# EasyEDA Pro project ProPrj_DiscoTech 6 Current_2026-05-06.epro, board Cue
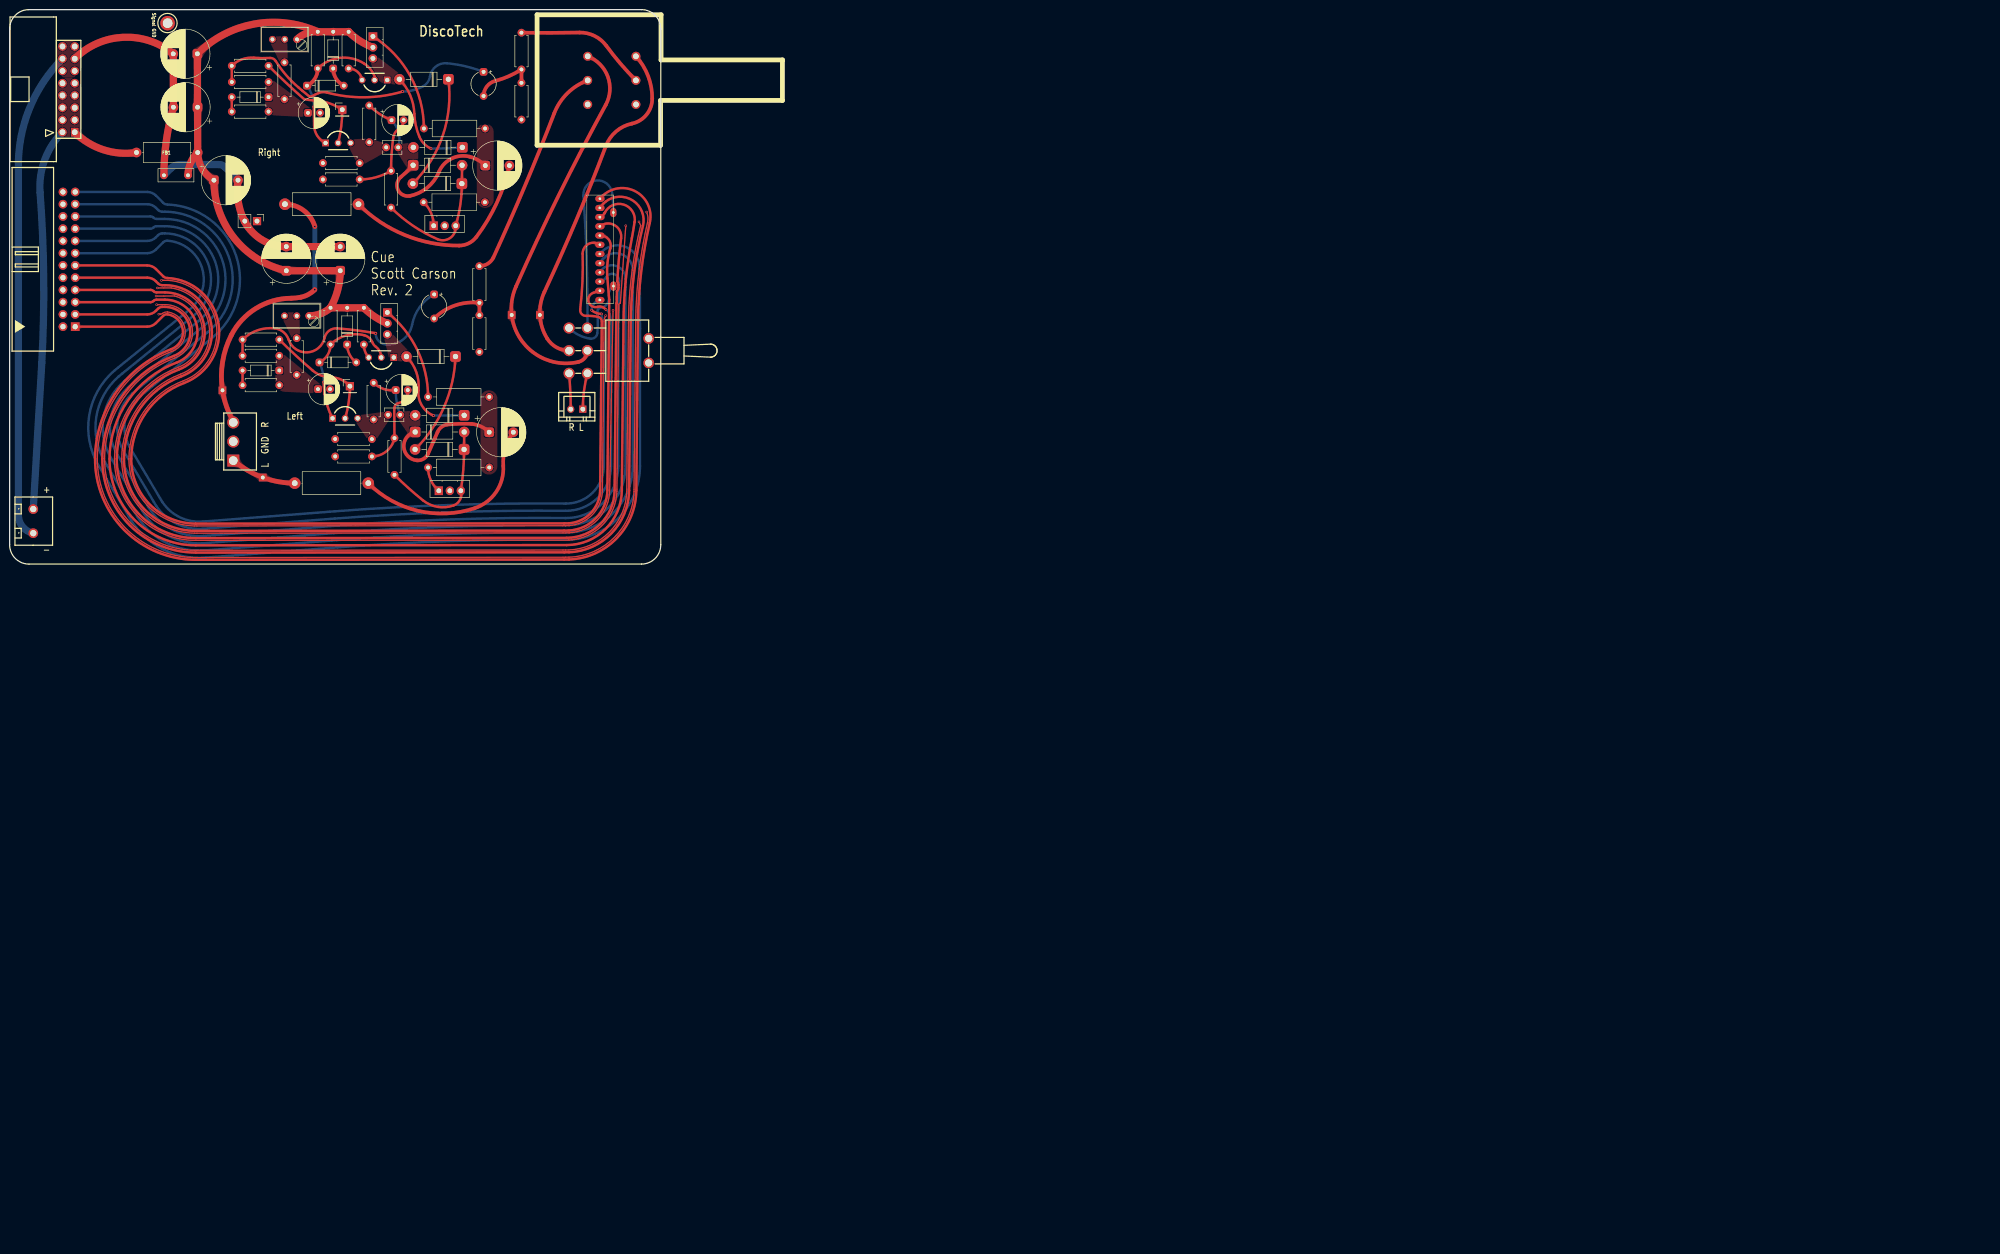
[diagram p18: board, top side]
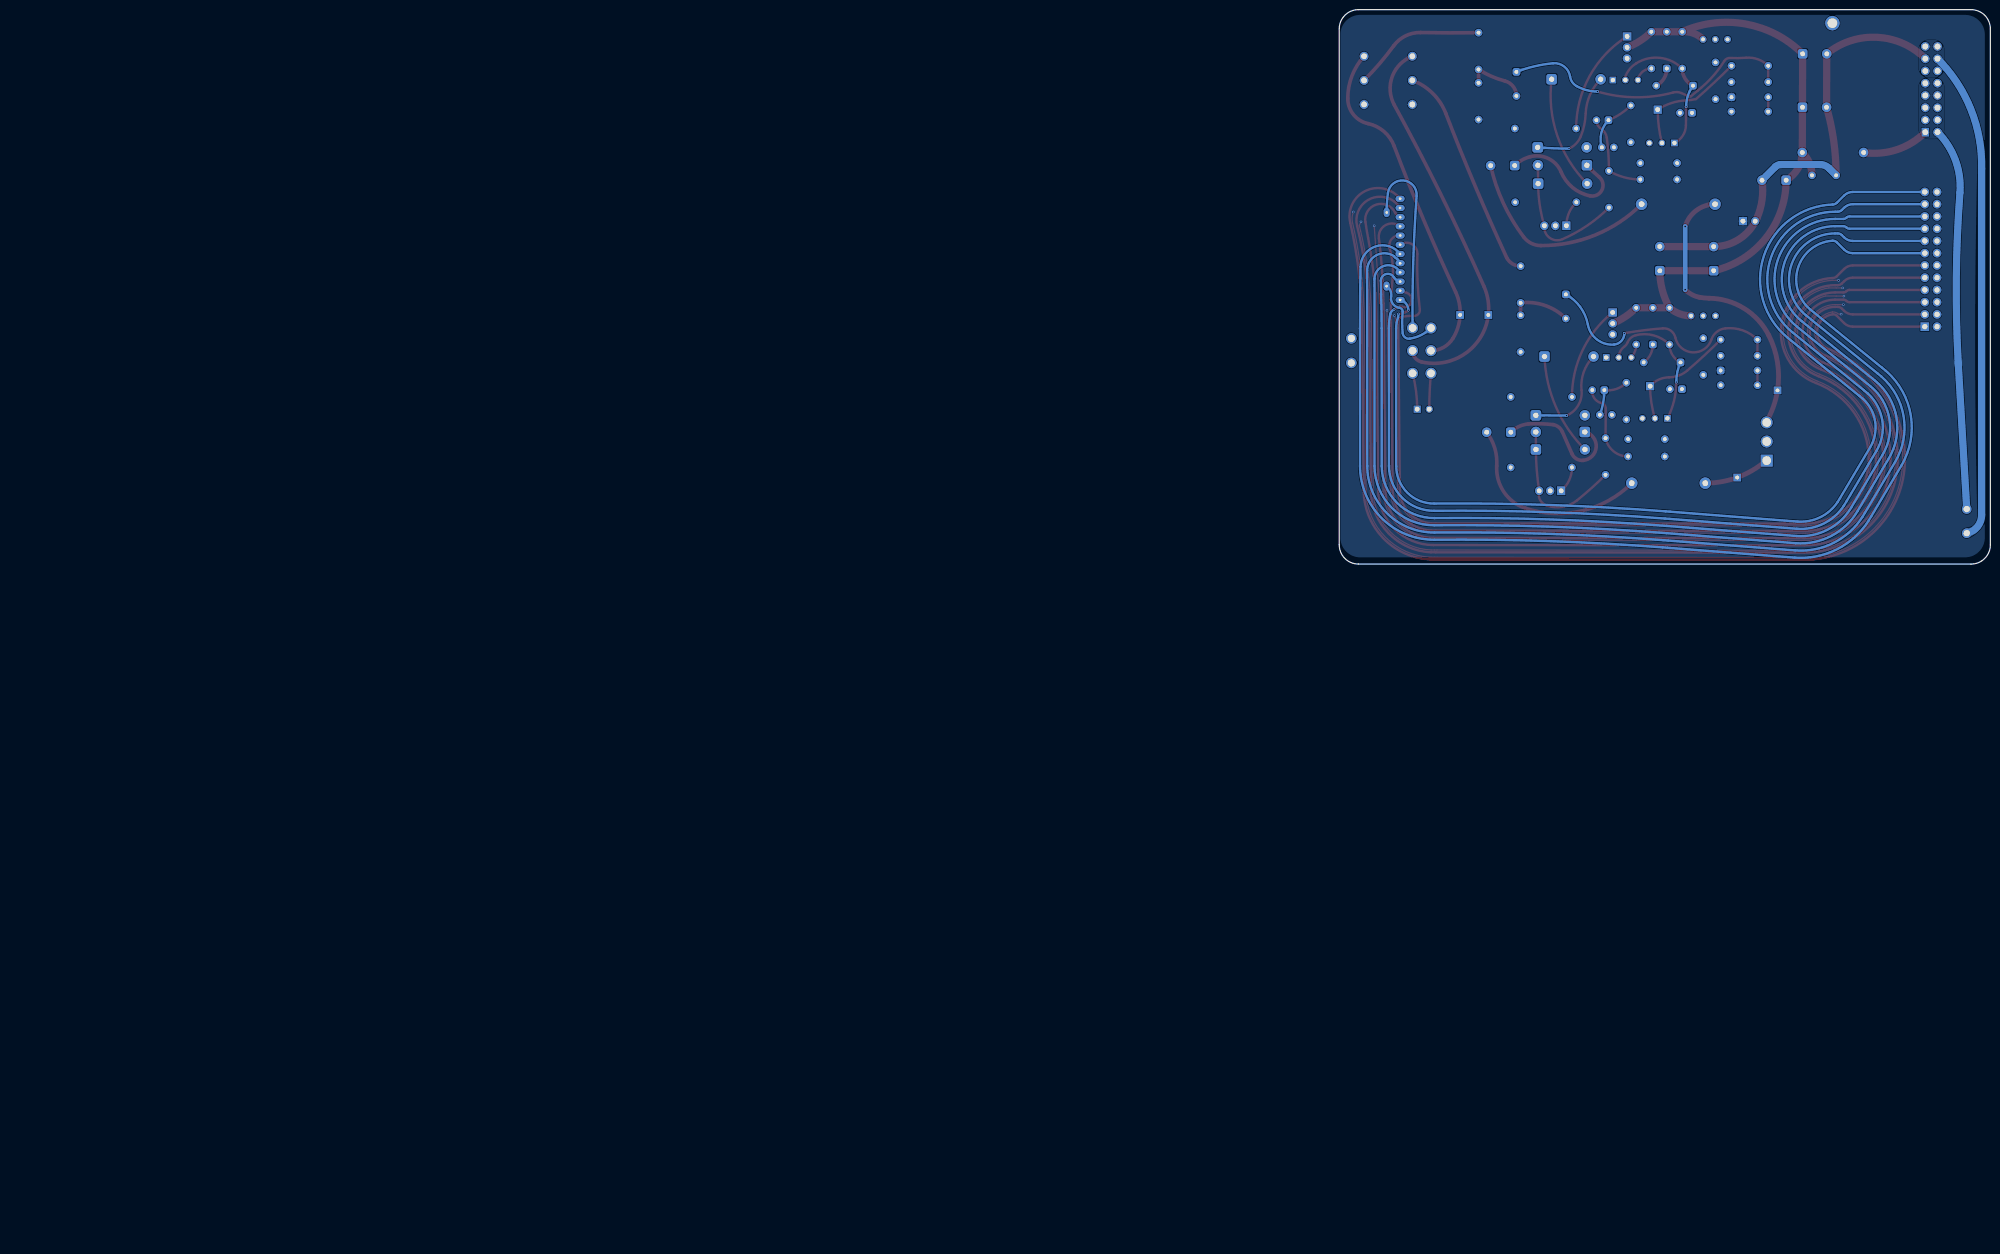
[diagram p19: board, bottom side, seen from below]

Outline 135 x 115 mm; copper layers: Top Layer, Bottom Layer. Coordinates in mm from the lower left corner of the outline.
Outline path: 0,111 arc(1.17,113.83) 4,115 131,115 arc(133.83,113.83) 135,111 135,4 arc(133.83,1.17) 131,0 4,0 arc(1.17,1.17) 0,4 0,111
Stack: Top Layer 0.035mm / Dielectric1 1.51mm FR4 er 4.5 / Bottom Layer 0.035mm

## Design rules (mm)
template: Custom Config
spacing copperThickness1oz (default): track to track 0.102, other pairs 0.152 to 0.3
spacing copperThickness2oz: track to track 0.203, other pairs 0.152 to 0.3
track width copperThickness1oz (default): min 0.127, default 0.75, max 2.54
track width copperThickness2oz: min 0.203, default 0.254, max 2.54
differential pair differentialPair (default): width min 0.127, default 0.254, max 2.54; gap min 0.152, default 0.152
via viaSize (default): diameter min 0.5, default 0.61, max 10; hole min 0.3, default 0.305, max 6.3
net $1N811 uses Baby Zone

## Placement (name value [footprint] x y rotation side)
C1  100uF  [Capacitor_THT:CP_Radial_D10.0mm_P5.00mm]  57.36 60.84 90 top
C2  100uF  [Capacitor_THT:CP_Radial_D10.0mm_P5.00mm]  68.54 60.85 90 top
C3  100uF  [Capacitor_THT:CP_Radial_D10.0mm_P5.00mm]  38.95 94.76 180 top
C4  100uF  [Capacitor_THT:CP_Radial_D10.0mm_P5.00mm]  38.92 105.84 180 top
C5  100uF  [Capacitor_THT:CP_Radial_D10.0mm_P5.00mm]  42.35 79.62 0 top
C6  100nF  [Capacitor_THT:C_Rect_L7.2mm_W2.5mm_P5.00mm_FKS2_FKP2_MKS2_MKP2]  31.98 80.64 0 top
C7  3.3 uF  [Capacitor_THT:CP_Radial_Tantal_D5.0mm_P5.00mm]  88.01 55.94 270 top
C8  3.3 uF  [Capacitor_THT:CP_Radial_Tantal_D5.0mm_P5.00mm]  98.26 102.09 270 top
C9  47 uF  [Capacitor_THT:CP_Radial_D6.3mm_P2.50mm]  63.94 36.29 0 top
C10  47 uF  [Capacitor_THT:CP_Radial_D6.3mm_P2.50mm]  61.85 93.59 0 top
C11  22 pF  [Capacitor_THT:C_Disc_D3.8mm_W2.6mm_P2.50mm]  78.47 30.96 0 top
C12  22 pF  [Capacitor_THT:C_Disc_D3.8mm_W2.6mm_P2.50mm]  78.06 86.43 0 top
C13  47 uF  [Capacitor_THT:CP_Radial_D6.3mm_P2.50mm]  80.04 36.09 0 top
C14  47 uF  [Capacitor_THT:CP_Radial_D6.3mm_P2.50mm]  79.18 92.07 0 top
C15  220 uF  [Capacitor_THT:CP_Radial_D10.0mm_P5.00mm]  99.43 27.35 0 top
C16  220 uF  [Capacitor_THT:CP_Radial_D10.0mm_P5.00mm]  98.61 82.66 0 top
CN1  From Master  [CONN-TH_2P-P2.50_HX-2.54MM-2P-ZZ-MS]  117.58 32.13 180 top
CN2  To HP  [CONN-TH_B3P-VH-LF-SN]  46.37 25.42 90 top
D1  1N4448  [Diode_THT:D_DO-35_SOD27_P7.62mm_Horizontal]  55.91 40.15 180 top
D2  1N4448  [Diode_THT:D_DO-35_SOD27_P7.62mm_Horizontal]  53.68 96.85 180 top
D3  1N4448  [Diode_THT:D_DO-35_SOD27_P7.62mm_Horizontal]  69.98 45.54 90 top
D4  1N4448  [Diode_THT:D_DO-35_SOD27_P7.62mm_Horizontal]  64.24 41.83 0 top
D5  1N4448  [Diode_THT:D_DO-35_SOD27_P7.62mm_Horizontal]  67.09 102.79 90 top
D6  1N4448  [Diode_THT:D_DO-35_SOD27_P7.62mm_Horizontal]  61.65 99.23 0 top
D7  1N4003  [Diode_THT:D_DO-41_SOD81_P10.16mm_Horizontal]  92.44 43.05 180 top
D8  1N4003  [Diode_THT:D_DO-41_SOD81_P10.16mm_Horizontal]  94.22 23.77 180 top
D9  1N4003  [Diode_THT:D_DO-41_SOD81_P10.16mm_Horizontal]  90.96 100.55 180 top
D10  1N4003  [Diode_THT:D_DO-41_SOD81_P10.16mm_Horizontal]  93.76 78.91 180 top
D11  1N4003  [Diode_THT:D_DO-41_SOD81_P10.16mm_Horizontal]  94.24 30.85 180 top
D12  1N4003  [Diode_THT:D_DO-41_SOD81_P10.16mm_Horizontal]  84.08 27.4 0 top
D13  1N4003  [Diode_THT:D_DO-41_SOD81_P10.16mm_Horizontal]  93.86 86.43 180 top
D14  1N4003  [Diode_THT:D_DO-41_SOD81_P10.16mm_Horizontal]  83.65 82.72 0 top
FB1  FerriteBead_Small  [Inductor_THT:L_Axial_L9.5mm_D4.0mm_P12.70mm_Horizontal_Fastron_SMCC]  26.29 85.37 0 top
JP1  GND Bridge  [Connector_PinHeader_2.54mm:PinHeader_1x02_P2.54mm_Vertical]  51.29 71.14 270 top
NOREF  -  [Pad_e1655]  109.93 51.67 270 top
NOREF#2  -  [Pad_e1669]  44.13 36.03 270 top
NOREF#3  -  [Pad_e1666]  52.49 17.96 270 top
NOREF#4  -  [Pad_e1663]  104.09 51.66 270 top
NOREF#5  -  [Pad_e1]  32.75 112.2 270 top
P1  Cue  [IDC-TH_24P-P2.54_ZHOURI_DC3-2.54-24PAL]  12.32 63.22 270 top
P2  Power  [CONN-TH_16P-P2.54_C9142]  12.22 98.47 270 top
P4  40V  [CONN-TH_WJ126V-5.0-2P]  4.9 8.91 0 top
Q1  BC550  [TO-92-3_L4.8-W3.7-P2.60-L_LP0003A]  69.55 30.23 0 top
Q2  BC550  [TO-92-3_L4.8-W3.7-P2.60-L_LP0003A]  68.1 87.35 0 top
Q3  BC560  [TO-92-3_L4.8-W3.7-P2.60-L_LP0003A]  77.04 42.85 180 top
Q4  BC560  [TO-92-3_L4.8-W3.7-P2.60-L_LP0003A]  75.67 100.4 180 top
Q5  BD139  [Package_TO_SOT_THT:TO-126-3_Vertical]  78.31 52.19 270 top
Q6  BD140  [Package_TO_SOT_THT:TO-126-3_Vertical]  88.98 15.21 0 top
Q7  BD139  [Package_TO_SOT_THT:TO-126-3_Vertical]  75.32 109.44 270 top
Q8  BD140  [Package_TO_SOT_THT:TO-126-3_Vertical]  87.91 70.18 0 top
R1  100k  [Resistor_THT:R_Axial_DIN0207_L6.3mm_D2.5mm_P7.62mm_Horizontal]  48.29 43.2 0 top
R2  100k  [Resistor_THT:R_Axial_DIN0207_L6.3mm_D2.5mm_P7.62mm_Horizontal]  46.06 99.98 0 top
R3  2k2  [Resistor_THT:R_Axial_DIN0207_L6.3mm_D2.5mm_P7.62mm_Horizontal]  48.29 46.55 0 top
R4  2k2  [Resistor_THT:R_Axial_DIN0207_L6.3mm_D2.5mm_P7.62mm_Horizontal]  46.06 103.35 0 top
R5  20k  [Potentiometer_THT:Potentiometer_Bourns_3296W_Vertical]  62.07 51.49 0 top
R6  10k  [Resistor_THT:R_Axial_DIN0207_L6.3mm_D2.5mm_P7.62mm_Horizontal]  59.52 46.86 270 top
R7  470R  [Resistor_THT:R_Axial_DIN0207_L6.3mm_D2.5mm_P7.62mm_Horizontal]  55.91 37.11 180 top
R8  20k  [Potentiometer_THT:Potentiometer_Bourns_3296W_Vertical]  59.57 108.83 0 top
R9  10k  [Resistor_THT:R_Axial_DIN0207_L6.3mm_D2.5mm_P7.62mm_Horizontal]  56.98 104.06 270 top
R10  470R  [Resistor_THT:R_Axial_DIN0207_L6.3mm_D2.5mm_P7.62mm_Horizontal]  53.68 93.85 180 top
R11  2k7  [Resistor_THT:R_Axial_DIN0207_L6.3mm_D2.5mm_P7.62mm_Horizontal]  66.53 53.16 270 top
R12  220R  [Resistor_THT:R_Axial_DIN0207_L6.3mm_D2.5mm_P7.62mm_Horizontal]  75.11 25.93 180 top
R13  2k7  [Resistor_THT:R_Axial_DIN0207_L6.3mm_D2.5mm_P7.62mm_Horizontal]  63.89 110.41 270 top
R14  220R  [Resistor_THT:R_Axial_DIN0207_L6.3mm_D2.5mm_P7.62mm_Horizontal]  72.57 83.18 180 top
R15  5k6  [Resistor_THT:R_Axial_DIN0207_L6.3mm_D2.5mm_P7.62mm_Horizontal]  75.47 37.61 270 top
R16  5k6  [Resistor_THT:R_Axial_DIN0207_L6.3mm_D2.5mm_P7.62mm_Horizontal]  74.55 95.12 270 top
R17  2k2  [Resistor_THT:R_Axial_DIN0207_L6.3mm_D2.5mm_P7.62mm_Horizontal]  75.11 22.32 180 top
R18  2k2  [Resistor_THT:R_Axial_DIN0207_L6.3mm_D2.5mm_P7.62mm_Horizontal]  72.57 79.78 180 top
R19  4k7  [Resistor_THT:R_Axial_DIN0207_L6.3mm_D2.5mm_P7.62mm_Horizontal]  79.79 26.13 270 top
R20  4k7  [Resistor_THT:R_Axial_DIN0207_L6.3mm_D2.5mm_P7.62mm_Horizontal]  79.07 81.56 270 top
R21  68R  [Resistor_THT:R_Axial_DIN0207_L6.3mm_D2.5mm_P7.62mm_Horizontal]  73.44 53.16 270 top
R22  68R  [Resistor_THT:R_Axial_DIN0207_L6.3mm_D2.5mm_P7.62mm_Horizontal]  70.29 110.41 270 top
R23  3R9  [Resistor_THT:R_Axial_DIN0309_L9.0mm_D3.2mm_P12.70mm_Horizontal]  86.75 34.67 0 top
R24  3R9  [Resistor_THT:R_Axial_DIN0309_L9.0mm_D3.2mm_P12.70mm_Horizontal]  99.45 20.04 180 top
R25  3R9  [Resistor_THT:R_Axial_DIN0309_L9.0mm_D3.2mm_P12.70mm_Horizontal]  85.88 90.34 0 top
R26  3R9  [Resistor_THT:R_Axial_DIN0309_L9.0mm_D3.2mm_P12.70mm_Horizontal]  98.53 75.05 180 top
R27  10R  [Resistor_THT:R_Axial_DIN0414_L11.9mm_D4.5mm_P15.24mm_Horizontal]  74.35 16.79 180 top
R28  10R  [Resistor_THT:R_Axial_DIN0414_L11.9mm_D4.5mm_P15.24mm_Horizontal]  72.32 74.65 180 top
R29  10K  [Resistor_THT:R_Axial_DIN0207_L6.3mm_D2.5mm_P7.62mm_Horizontal]  97.39 61.8 270 top
R30  10K  [Resistor_THT:R_Axial_DIN0207_L6.3mm_D2.5mm_P7.62mm_Horizontal]  97.39 44 90 top
R31  10K  [Resistor_THT:R_Axial_DIN0207_L6.3mm_D2.5mm_P7.62mm_Horizontal]  106.11 92.2 90 top
R32  10K  [Resistor_THT:R_Axial_DIN0207_L6.3mm_D2.5mm_P7.62mm_Horizontal]  106.11 102.6 90 top
RS1  2P6T  [Library:Grayhill 71 series 2P6T Rotary Switch]  116.06 56.54 90 top
SW1  7203SYABE  [SW-TH_7203SYABE]  124.24 44.27 90 top
TP1  TestPoint  [Connector_PinHeader_2.54mm:PinHeader_1x01_P2.54mm_Vertical]  70.54 36.9 0 top
TP2  TestPoint  [Connector_PinHeader_2.54mm:PinHeader_1x01_P2.54mm_Vertical]  68.97 94.26 0 top
U1  Volume 50k  [RES-ADJ-TH_RK27112A0A16]  124.85 100.33 0 top

## Footprints (pads in the part's own frame, mm; a bottom-side part is the same pattern mirrored in y, then rotated)
Capacitor_THT:C_Disc_D3.8mm_W2.6mm_P2.50mm
  round 1.6 hole 0.8: 1(0,0) 2(2.5,0)
Capacitor_THT:C_Rect_L7.2mm_W2.5mm_P5.00mm_FKS2_FKP2_MKS2_MKP2
  round 1.6 hole 0.8: 1(0,0) 2(5,0)
Capacitor_THT:CP_Radial_D6.3mm_P2.50mm
  rrect 1.6x1.6 hole 0.8: 1(0,0)
  round 1.6 hole 0.8: 2(2.5,0)
Capacitor_THT:CP_Radial_D10.0mm_P5.00mm
  rrect 2x2 hole 1: 1(0,0)
  round 2 hole 1: 2(5,0)
Capacitor_THT:CP_Radial_Tantal_D5.0mm_P5.00mm
  rrect 1.6x1.6 hole 0.8: 1(0,0)
  round 1.6 hole 0.8: 2(5,0)
CONN-TH_2P-P2.50_HX-2.54MM-2P-ZZ-MS
  rect 1.5x1.5 hole 1: 1(-1.25,0)
  round 1.5 hole 1: 2(1.25,0)
CONN-TH_16P-P2.54_C9142
  rect 1.8x1.524 hole 1.2: 1(8.89,1.27)
  round 1.8 hole 1.2: 2(8.89,-1.27) 3(6.35,1.27) 4(6.35,-1.27) 5(3.81,1.27) 6(3.81,-1.27) 7(1.27,1.27) 8(1.27,-1.27) 9(-1.27,1.27) 10(-1.27,-1.27) 11(-3.81,1.27) 12(-3.81,-1.27) 13(-6.35,1.27) 14(-6.35,-1.27) 15(-8.89,1.27) 16(-8.89,-1.27)
CONN-TH_B3P-VH-LF-SN
  rect 2.5x2.5 hole 1.8: 1(-3.96,0)
  round 2.5 hole 1.8: 2(0,0) 3(3.96,0)
CONN-TH_WJ126V-5.0-2P
  round 2 hole 1.3: 1(0,2.501) 2(0,-2.501)
Connector_PinHeader_2.54mm:PinHeader_1x01_P2.54mm_Vertical
  rect 1.7x1.7 hole 1: 1(0,0)
Connector_PinHeader_2.54mm:PinHeader_1x02_P2.54mm_Vertical
  rect 1.7x1.7 hole 1: 1(0,0)
  round 1.7 hole 1: 2(0,-2.54)
Diode_THT:D_DO-35_SOD27_P7.62mm_Horizontal
  rrect 1.6x1.6 hole 0.8: 1(0,0)
  round 1.6 hole 0.8: 2(7.62,0)
Diode_THT:D_DO-41_SOD81_P10.16mm_Horizontal
  rrect 2.2x2.2 hole 1.1: 1(0,0)
  round 2.2 hole 1.1: 2(10.16,0)
IDC-TH_24P-P2.54_ZHOURI_DC3-2.54-24PAL
  rect 1.8x1.8 hole 1.1: 1(13.97,1.27)
  round 1.8 hole 1.1: 2(13.97,-1.27) 3(11.43,1.27) 4(11.43,-1.27) 5(8.89,1.27) 6(8.89,-1.27) 7(6.35,1.27) 8(6.35,-1.27) 9(3.81,1.27) 10(3.81,-1.27) 11(1.27,1.27) 12(1.27,-1.27) 13(-1.27,1.27) 14(-1.27,-1.27) 15(-3.81,1.27) 16(-3.81,-1.27) 17(-6.35,1.27) 18(-6.35,-1.27) 19(-8.89,1.27) 20(-8.89,-1.27) 21(-11.43,1.27) 22(-11.43,-1.27) 23(-13.97,1.27) 24(-13.97,-1.27)
Inductor_THT:L_Axial_L9.5mm_D4.0mm_P12.70mm_Horizontal_Fastron_SMCC
  round 2 hole 1: 1(0,0) 2(12.7,0)
Library:Grayhill 71 series 2P6T Rotary Switch
  oval 1.27x1.905 hole 0.55: 1(19.233,-6.32) 2(17.325,-6.32) 3(15.42,-6.31) 4(13.51,-6.31) 5(11.605,-6.31) 6(9.695,-6.31) 7(7.78,-6.32) 8(5.872,-6.32) 9(3.967,-6.31) 10(2.058,-6.31) 11(0.152,-6.31) 12(-1.758,-6.31)
  oval 1.905x1.27 hole 0.55: 13(16.38,-9.105) 14(1.12,-9.125)
Package_TO_SOT_THT:TO-126-3_Vertical
  rect 1.71x1.8 hole 1: 1(0,0)
  oval 1.71x1.8 hole 1: 2(2.28,0) 3(4.56,0)
Pad_e1
  round 3 hole 2: 1(0,0)
Pad_e1655
  rect 1.6x1.6 hole 0.8: 1(0,0)
Pad_e1663
  rect 1.6x1.6 hole 0.8: 1(0,0)
Pad_e1666
  rect 1.6x1.6 hole 0.8: 2(0,0)
Pad_e1669
  rect 1.6x1.6 hole 0.8: 3(0,0)
Potentiometer_THT:Potentiometer_Bourns_3296W_Vertical
  round 1.44 hole 0.8: 1(0,0) 2(-2.54,0) 3(-5.08,0)
RES-ADJ-TH_RK27112A0A16
  round 1.85 hole 1.2: 1(-5,5) 2(-5,0) 3(-5,-5) 4(5,-5) 5(5,0) 6(5,5)
Resistor_THT:R_Axial_DIN0207_L6.3mm_D2.5mm_P7.62mm_Horizontal
  round 1.6 hole 0.8: 1(0,0) 2(7.62,0)
Resistor_THT:R_Axial_DIN0309_L9.0mm_D3.2mm_P12.70mm_Horizontal
  round 1.6 hole 0.8: 1(0,0) 2(12.7,0)
Resistor_THT:R_Axial_DIN0414_L11.9mm_D4.5mm_P15.24mm_Horizontal
  round 2.4 hole 1.2: 1(0,0) 2(15.24,0)
SW-TH_7203SYABE
  round 2.3 hole 1.6: 1(4.7,4.445) 2(0,4.445) 3(-4.7,4.445) 4(4.7,8.255) 5(0,8.255) 6(-4.7,8.255)
  round 2.2 hole 1.5: 7(2.54,-8.255) 8(-2.54,-8.255)
TO-92-3_L4.8-W3.7-P2.60-L_LP0003A
  rect 1.4x1.4 hole 0.9: 1(-2.6,0)
  round 1.4 hole 0.9: 2(0,0) 3(2.6,0)

## Nets
As in the schematic, except:
GNDS: C9.2 C10.2 CN2.2 D1.1 D2.1 JP1.1 NOREF#5.1 P1.2 P1.4 P1.6 P1.8 P1.10 P1.12 P1.14 P1.16 P1.18 P1.20 P1.22 P1.24 Q6.2 Q8.2 R12.2 R14.2 R17.2 R18.2 R30.1 R31.1 U1.3 U1.4
$1N2652: NOREF#4.1 SW1.2 U1.1
$1N2658: NOREF.1 SW1.5 U1.6
$2N2061: CN2.1 NOREF#3.2 R27.2
$2N2069: CN2.3 NOREF#2.3 R28.2

Pads without a net: SW1 7 8

## Via types
v1: diameter 0.5, hole 0.305, Top Layer to Bottom Layer, 3 vias
v2: diameter 0.5, hole 0.3, Top Layer to Bottom Layer, 10 vias
v3: diameter 0.75, hole 0.375, Top Layer to Bottom Layer, 2 vias
v4: diameter 0.61, hole 0.305, Top Layer to Bottom Layer, 6 vias

## Routing (per net, layer and track width the routed paths; a pad name or vN(x,y) marks a point on that pad's centre or on a via; arc(x,y) is an arc through that point)
40V: length 93.5
  Top Layer w1.5: P2.1 arc(19.39,85.95) FB1.1
  Bottom Layer w1.5: P4.1 6.66,41.76 arc(7.06,59.41) 6.31,77.05 arc(7.26,83.82) P2.2
GNDREF: length 198.2
  Top Layer w1.5: C2.2 C1.2 arc(51.99,67.45) 48.39,71.75 arc(47.33,75.62) C5.2 ; C6.1 arc(32.48,87.77) C3.2 C4.2 arc(23.51,109.27) P2.13
  Bottom Layer w1.5: C5.2 44.55,82.43 arc(44.06,82.75) 43.49,82.86 35.26,82.86 arc(34.29,82.67) 33.46,82.12 C6.1 ; P2.14 arc(4.04,94.35) 1.82,82 arc(2.25,46.12) 1.82,10.24 arc(2.66,7.76) P4.2
GNDS: length 1081.2
  Top Layer w0.25: v2(31.48,58.85) 31.98,58.85 arc(32.41,58.85) 32.85,58.85 arc(42.84,49.69) 35.99,38 arc(27.85,31.66) 24.73,21.83 arc(28.67,12.08) 38.33,7.91 arc(38.58,7.91) 38.83,7.91 114.72,7.96 arc(114.97,7.96) 115.22,7.97 arc(115.6,7.97) 115.99,7.98 116,7.98 arc(120.8,10.22) 122.9,15.08 arc(122.9,15.33) 122.91,15.58 123.25,50.32 arc(123.33,50.92) 123.58,51.48 ; v2(30.61,57.27) 31.98,57.27 arc(32.74,57.27) 33.49,57.28 arc(41.41,49.1) 35.46,39.41 arc(26.61,32.52) 23.23,21.83 arc(27.61,11.02) 38.33,6.41 arc(38.58,6.41) 38.83,6.41 114.72,6.46 arc(114.97,6.46) 115.22,6.47 arc(115.6,6.47) 115.98,6.48 116,6.48 arc(121.94,9.24) 124.4,15.32 v2(125.1,52.65) ; v2(130.48,70.99) 130.83,70.24 arc(129,60.45) 128.3,50.52 arc(128.29,50.27) 128.29,50.02 127.95,15.53 arc(127.95,15.28) 127.94,15.03 arc(124.34,6.62) 115.96,2.93 arc(115.59,2.92) 115.22,2.92 arc(114.97,2.92) 114.72,2.92 38.84,2.86 arc(38.59,2.86) 38.34,2.86 arc(25.1,8.52) 19.69,21.85 arc(23.7,34.54) 34.2,42.72 arc(37.82,49.12) 32.18,53.82 31.66,53.82 arc(31.52,53.82) 31.38,53.8 v2(30.47,53.8) ; v2(30.36,55.6) 31.98,55.6 arc(33.09,55.6) 34.19,55.6 arc(39.95,48.47) 34.93,40.81 arc(25.38,33.38) 21.73,21.84 arc(26.55,9.96) 38.33,4.91 arc(38.58,4.91) 38.83,4.91 115.95,4.96 arc(115.94,4.97) 115.95,4.98 arc(122.89,8.07) 125.9,15.05 arc(125.9,15.3) 125.91,15.55 126.28,53.9 126.62,54.12 v2(127.74,70.18) ; v2(30.92,51.84) 31.25,51.84 arc(31.48,51.88) 31.69,52 arc(32.17,52.23) 32.71,52.29 32.74,52.29 arc(36.39,48.57) 33.68,44.13 arc(22.47,35.4) 18.19,21.86 arc(24.03,7.46) 38.34,1.36 arc(38.59,1.36) 38.84,1.36 114.72,1.42 arc(114.97,1.42) 115.22,1.42 arc(115.59,1.42) 115.96,1.43 arc(125.39,5.55) 129.44,15.02 arc(129.45,15.27) 129.45,15.52 129.79,50.01 arc(129.79,50.26) 129.8,50.51 arc(130.48,60.77) 132.25,70.89 arc(132.33,71.97) v2(132.06,73.02)
  vias: v2(123.58,51.53)
LEFT: length 46.1
  Top Layer w0.75: U1.2 arc(115.64,97.66) 112.91,93.49 arc(106.82,78.42) 100.28,63.55 arc(99.08,62.27) R29.1
RIGHT: length 27.9
  Top Layer w0.75: U1.5 arc(126.64,103.8) 123.71,107.5 arc(121.27,109.55) 118.15,110.25 arc(112.13,110.19) R32.2
VDC: length 139.7
  Top Layer w1.5: R13.1 D5.2 R22.1 arc(72.63,108.52) 75.32,107.16 ; R13.1 arc(61.55,110.1) R8.1 ; R13.1 arc(50.69,112.01) C4.1 C3.1 FB1.2 ; R11.1 R21.1 arc(75.71,51.29) Q5.2 ; R11.1 arc(68.03,56.88) C2.1 C1.1 arc(46.56,67.6) C5.1 arc(39.89,82.04) FB1.2 ; R11.1 arc(64.45,51.92) R5.1 ; FB1.2 arc(37.51,83.21) C6.2
$1N811: length 263.3
  Top Layer w0.5: P1.1 28.53,49.25 arc(29.5,49.44) 30.33,49.99 31.83,51.49 arc(32.22,51.75) 32.68,51.81 arc(35.91,48.52) 33.51,44.57 arc(22.08,35.67) 17.71,21.87 arc(23.78,7.03) 38.59,0.88 114.97,0.94 arc(115.47,0.94) 115.97,0.95 arc(125.82,5.31) 129.93,15.26 130.27,50.25 arc(130.94,60.59) 132.72,70.79 arc(129.54,77.41) RS1.1
$1N815: length 257.9
  Top Layer w0.5: P1.3 28.53,51.79 arc(29.5,51.98) 30.33,52.53 30.77,52.98 arc(31.18,53.25) 31.66,53.35 32.18,53.35 arc(37.35,49.03) 34.04,43.17 arc(23.31,34.82) 19.21,21.86 arc(24.85,8.09) 38.59,2.38 114.97,2.44 arc(115.47,2.44) 115.97,2.45 arc(124.76,6.37) 128.43,15.28 128.77,50.27 arc(129.45,60.27) 131.3,70.13 arc(129.21,75.41) 123.53,75.15 arc(123.38,74.99) 123.19,74.86 arc(122.75,74.39) RS1.2
$1N821: length 253
  Top Layer w0.5: P1.5 29.21,54.33 arc(29.55,54.39) 29.84,54.59 arc(30.13,54.78) 30.47,54.85 32.18,54.85 arc(38.83,49.3) 34.57,41.77 arc(24.54,33.96) 20.71,21.85 arc(25.91,9.15) 38.59,3.88 115.47,3.94 arc(123.53,7.26) 126.93,15.29 127.27,50.28 arc(127.75,59) 129.01,67.64 arc(129.31,69.31) 129.57,70.99 ; 123.37,72.82 arc(123.37,72.82) 123.37,72.82 ; 123.37,72.82 arc(122.95,72.3) RS1.3 ; 123.37,72.82 arc(127.32,74.57) 129.57,70.89 ; 123.37,72.82 arc(123.4,72.87) 123.42,72.92
$1N827: length 242.9
  Top Layer w0.5: 13.59,56.87 29.21,56.87 arc(29.55,56.8) 29.84,56.61 arc(30.13,56.41) 30.47,56.35 32.18,56.35 arc(40.3,49.57) 35.09,40.36 arc(25.78,33.1) 22.21,21.84 arc(26.97,10.21) 38.58,5.38 115.47,5.44 arc(122.48,8.33) 125.43,15.31 125.81,54.07 arc(125.82,54.11) 125.86,54.12 arc(125.87,54.55) 125.87,54.97 arc(125.91,55.18) 125.88,55.38 arc(125.9,55.99) 125.91,56.6 arc(126.14,56.94) 126.22,57.34 126.22,57.98 arc(126.16,58.32) 125.99,58.63 arc(126.3,63.11) 126.78,67.59 arc(125.4,70.3) RS1.4
$1N833: length 236.2
  Top Layer w0.5: P1.9 28.53,59.41 arc(29.5,59.21) 30.33,58.66 30.77,58.21 arc(31.18,57.94) 31.66,57.85 32.18,57.85 arc(41.78,49.84) 35.62,38.96 arc(27.01,32.25) 23.71,21.83 arc(28.04,11.26) 38.58,6.88 114.97,6.94 arc(115.47,6.95) 115.97,6.96 arc(121.6,9.57) 123.93,15.32 124.31,54.82 123.93,59.3 arc(123.95,62.43) 124.54,65.5 arc(124.15,67.4) RS1.5
$1N839: length 237.4
  Top Layer w0.5: P1.11 28.53,61.95 arc(29.5,61.75) 30.33,61.2 31.83,59.7 arc(32.22,59.44) 32.68,59.34 arc(43.3,49.86) 36.15,37.56 arc(28.24,31.39) 25.21,21.82 arc(29.1,12.32) 38.58,8.38 114.97,8.44 arc(115.47,8.45) 115.97,8.46 arc(120.54,10.64) 122.43,15.34 122.77,50.33 arc(122.56,50.94) 122,51.28 arc(120.76,51.45) 119.51,51.48 arc(118.6,51.86) 118.29,52.8 arc(118.76,58.56) 118.8,64.33 arc(120,66.39) RS1.6
$1N845: length 1003.7
  Bottom Layer w0.5: P1.13 28.53,64.49 arc(29.5,64.68) 30.33,65.23 31.83,66.73 arc(32.22,66.99) 32.68,67.07 arc(39.87,61.48) 37.27,52.75 22.43,40.71 arc(22.05,40.4) 21.66,40.08 arc(16.49,30.81) 18.47,20.39 24.71,9.88 arc(24.97,9.45) 25.23,9.02 arc(31.83,3.05) 40.57,1.34 66.93,3.39 arc(408.45,-112.91) 67.92,3.46 arc(91.57,4.76) 115.24,5.05 arc(126.15,9.48) 130.69,20.34 130.7,48.89 arc(130.67,55.26) 130.59,61.64 arc(127.44,65.9) RS1.7
$1N851: length 998.5
  Bottom Layer w0.5: P1.15 28.53,67.03 arc(29.5,67.22) 30.33,67.77 30.77,68.22 arc(31.18,68.49) 31.66,68.59 32.18,68.59 arc(41.2,62.22) 38.21,51.59 23.38,39.55 arc(22.99,39.23) 22.61,38.91 arc(17.97,30.55) 19.76,21.16 26,10.64 arc(26.26,10.21) 26.52,9.78 arc(32.52,4.38) 40.45,2.84 66.81,4.88 arc(408.34,-111.25) 67.81,4.96 arc(91.52,6.26) 115.26,6.55 arc(125.1,10.54) 129.19,20.34 129.21,60.88 arc(127.32,64.05) 123.63,63.86 arc(123.37,63.53) 123,63.33 arc(122.66,62.89) RS1.8
$1N857: length 252.1
  Bottom Layer w0.5: P1.17 29.21,69.57 arc(29.55,69.63) 29.84,69.83 arc(30.13,70.02) 30.47,70.09 32.18,70.09 arc(42.61,62.72) 39.16,50.42 23.93,38.07 arc(19.49,30.53) 21.05,21.92 27.55,10.98 arc(32.99,5.83) 40.34,4.33 67.19,6.42 arc(91.22,7.75) 115.27,8.05 arc(124.04,11.61) 127.69,20.34 127.69,59.15 arc(125.56,61.9) RS1.9
$1N863: length 247.3
  Bottom Layer w0.5: P1.19 29.21,72.11 arc(29.55,72.04) 29.84,71.85 arc(30.13,71.65) 30.47,71.59 32.18,71.59 arc(44.03,63.22) 40.1,49.26 24.88,36.9 arc(20.97,30.27) 22.34,22.69 28.84,11.74 arc(33.68,7.16) 40.22,5.83 67.08,7.91 arc(91.16,9.25) 115.29,9.55 arc(122.99,12.68) 126.19,20.34 126.2,48.89 arc(126.23,52.45) 126.32,56 arc(126.35,57.37) 126.37,58.75 arc(125.31,60.15) 123.68,59.51 arc(123.12,58.92) RS1.10
$1N869: length 1022.6
  Top Layer w0.5: RS1.11 121.03,56.27 arc(120.04,54.36) 121.95,53.36 arc(122.55,53.41) 123.12,53.21 arc(123.38,53.02) v1(123.63,52.8)
  Bottom Layer w0.5: 13.59,74.65 28.53,74.65 arc(29.5,74.45) 30.33,73.9 30.77,73.45 arc(31.18,73.18) 31.66,73.09 32.18,73.09 arc(45.44,63.72) 41.05,48.09 26.21,36.05 arc(25.83,35.74) 25.45,35.41 arc(22.4,29.76) 23.63,23.45 29.87,12.94 arc(30.13,12.51) 30.39,12.08 arc(34.6,8.38) 40.1,7.32 66.46,9.37 arc(410.66,-141.1) 67.46,9.44 arc(91.36,10.76) 115.3,11.05 arc(121.93,13.74) 124.69,20.34 124.7,48.89 arc(124.64,50.34) 124.44,51.79 arc(124.16,52.4) v1(123.63,52.8)
$1N875: length 1016.8
  Top Layer w0.5: v1(122.71,51.89) arc(121.62,52.09) v1(120.66,52.65)
  Bottom Layer w0.5: P1.23 28.53,77.19 arc(29.5,76.99) 30.33,76.44 31.83,74.94 arc(32.22,74.68) 32.68,74.58 arc(46.94,63.99) 41.99,46.93 27.16,34.89 arc(26.77,34.57) 26.39,34.25 arc(23.88,29.49) 24.92,24.22 31.16,13.7 arc(31.42,13.27) 31.68,12.85 arc(35.29,9.71) 39.99,8.82 66.35,10.86 arc(410.53,-139.75) 67.34,10.94 arc(91.31,12.26) 115.31,12.55 arc(120.88,14.81) 123.19,20.35 123.2,48.89 arc(123.1,50.03) 122.81,51.13 arc(122.74,51.5) v1(122.71,51.89) ; v1(120.66,52.65) arc(121.14,54.02) RS1.12
$1N2652: length 82.6
  Top Layer w0.75: U1.1 arc(124.01,101.12) 123.58,95.22 arc(113.89,76.59) 104.98,57.58 arc(104.14,54.68) NOREF#4.1 arc(108.83,43.7) 117.94,41.93 arc(119.27,42.78) SW1.2
$1N2658: length 72.6
  Top Layer w0.75: U1.6 arc(132.36,101.25) 133.23,96.54 arc(132.03,93.21) 129.01,91.36 arc(125.73,89.74) 123.63,86.74 arc(117.54,71.48) 110.88,56.46 arc(110.11,54.12) NOREF.1 arc(110.38,49.14) 111.43,46.81 arc(113.38,44.95) SW1.5
$1N5183: length 40.7
  Bottom Layer w0.5: RS1.13 arc(125.1,74.96) 124.9,76.98 arc(121.63,79.56) 118.95,76.37 arc(119.65,62.68) SW1.1
$1N5191: length 18.4
  Bottom Layer w0.5: SW1.4 arc(118,47.51) 120.38,46.76 arc(121.36,47.02) 121.85,47.93 arc(121.94,50.14) 121.85,52.35 arc(122.02,52.88) 122.51,53.16 arc(123.87,53.96) 124.24,55.49 arc(124.38,56.72) RS1.14
$1N5223: length 7.5
  Top Layer w0.5: CN1.1 arc(119.07,35.88) 119.79,39.57
$1N5232: length 7.5
  Top Layer w0.5: CN1.2 arc(116.24,35.85) 115.98,39.57
$2N1850: length 30.3
  Top Layer w0.5: D4.1 arc(65.91,43.36) R11.2 arc(69.77,47.42) 73.51,47.46 arc(74.53,46.93) 75.21,45.99 arc(75.5,45.48) 75.92,45.07 arc(76.75,44.09) Q3.2 ; v4(65.12,37.75) arc(65.58,33.88) Q1.1
  Bottom Layer w0.5: v4(65.12,37.75) arc(64.9,39.83) D4.1
$2N1856: length 20.6
  Top Layer w0.5: v4(87.86,30.81) arc(85.45,32.91) 84.76,36.04 arc(84.31,39.82) D7.2
  Bottom Layer w0.5: v4(87.86,30.81) D11.1
$2N1868: length 30.6
  Top Layer w0.5: D12.2 D8.1 arc(94.05,19.48) Q6.3 arc(93.4,13.38) 92.03,12.16 arc(88.71,11.87) 85.68,13.23 arc(82.66,15.79) R19.2
$2N1890: length 2.9
  Top Layer w0.5: R21.2 arc(73.7,44.1) 74.44,42.85
$2N1892: length 38.3
  Top Layer w0.5: R15.1 arc(77.57,36.31) C13.1
  Top Layer w0.75: C15.1 arc(97.73,28.54) 95.74,29.08 arc(93.19,29.1) 90.66,28.93 arc(89.5,28.41) 88.73,27.4 86.75,22.88 arc(85.82,21.83) 84.46,21.51 arc(81.71,24.29) D12.1
  Bottom Layer w0.5: C13.1 arc(80.27,33.48) C11.2
$2N1936: length 40.8
  Top Layer w0.5: R16.1 arc(76.71,93.36) C14.1
  Top Layer w0.75: D14.1 arc(82.42,81.46) 81.11,80.29 arc(80.53,77.6) 82.99,76.37 arc(86.6,78.09) 88.98,81.3 arc(91.58,84.09) 95.38,84.5 arc(97.12,83.8) C16.1
  Bottom Layer w0.5: C14.1 arc(80.66,89.44) C12.2
$2N1958: length 55.2
  Top Layer w0.5: R1.1 R3.1 arc(51.35,48.48) 54.94,48.89 arc(56.73,48.15) 57.84,46.55 arc(61.73,43.91) 65.31,46.96 arc(66.24,48.41) 67.9,48.89 arc(71.92,48.48) 75.93,47.88
  Bottom Layer w0.5: 87.97,55.92 arc(86.38,54.81) 85.07,53.38 arc(84.05,51.61) 83.44,49.65 arc(81.52,46.55) 78.01,45.54 arc(76.5,46.28) v4(75.89,47.85)
$2N1962: length 5.4
  Top Layer w0.5: Q8.1 arc(87.37,72.83) R26.2
$2N1964: length 24.8
  Top Layer w0.5: R3.2 arc(59.3,43.29) 62.82,40.15 arc(64.6,39.1) 66.63,38.73 arc(68.79,38.25) TP1.1 arc(70.29,33.53) Q1.2
$2N1975: length 17.8
  Top Layer w0.5: C13.2 arc(82.1,34.39) 80.65,33.4 arc(79.99,32.97) 79.74,32.23 R19.1 arc(78.13,23.4) R17.1
$2N1979: length 18.1
  Top Layer w0.5: R18.1 arc(75.94,80.23) R20.1 arc(79.19,85.02) 79.53,88.46 arc(79.91,89.51) 80.7,90.29 arc(81.42,91.06) C14.2
$2N1983: length 3
  Top Layer w0.5: D2.2 R10.2
$2N2000: length 62.8
  Top Layer w0.5: R2.1 R4.1 arc(48.16,104.69) 50.63,105.02 arc(52.3,104.94) 53.98,104.97 arc(54.65,104.83) 55.15,104.36 arc(57.3,101.44) 59.87,98.88 arc(60.24,98.56) 60.61,98.25 arc(60.68,98.18) 60.76,98.13 arc(61.41,97.59) 62.06,97.05 arc(62.3,96.95) 62.56,97 arc(63.32,97.37) 64.09,97.71 arc(64.92,97.9) 65.77,97.81 arc(73.63,96.82) v4(81.46,98.01)
  Bottom Layer w0.5: C8.1 arc(94.52,103.24) 90.66,103.88 arc(88.35,103.2) 87.14,101.12 arc(86.68,99.97) 85.77,99.13 arc(83.69,98.3) v4(81.46,98.01)
$2N2004: length 22.9
  Top Layer w0.5: D9.2 arc(83.03,97.29) 83.9,93.44 arc(84.2,91.04) 84.92,88.72 arc(85.89,87.22) v4(87.35,86.18)
  Bottom Layer w0.5: v4(87.35,86.18) arc(90.61,86.24) D13.1
$2N2010: length 30.1
  Top Layer w0.5: D14.2 D10.1 arc(93.43,74.5) Q8.3 arc(91.41,67.7) 88.73,67.38 arc(83.59,70.2) R20.2
$2N2016: length 23.7
  Top Layer w0.5: D10.2 arc(89.8,88.88) D9.1
$2N2018: length 25.4
  Top Layer w0.5: Q2.2 arc(68.75,90.77) TP2.1 arc(66.13,95.63) 63.02,96.19 arc(62.05,96.27) 61.09,96.44 ; R4.2 arc(57.3,99.84) 61.04,96.44
$2N2021: length 22.8
  Top Layer w0.5: R25.1 arc(83.06,101.26) Q7.1
$2N2023: length 43.8
  Top Layer w0.75: C16.2 arc(100.98,74.88) 96.75,67.84 arc(95.18,66.54) 93.2,66.06 arc(81.9,68.26) R28.1
$2N2025: length 32.1
  Top Layer w0.5: Q2.1 arc(63.79,88.82) 63.12,90.97 arc(63.09,92.92) v4(63.07,94.86) ; 75.87,100.55 arc(74.97,102.43) 73.44,103.86 arc(68.47,105) R13.2
  Top Layer w0.75: R13.2 arc(63.28,100.69) D6.1
  Bottom Layer w0.5: v4(63.07,94.86) arc(62.71,97.16) D6.1
$2N2037: length 20.1
  Top Layer w0.5: R23.1 arc(84.53,44.39) Q5.1
$2N2039: length 21.5
  Top Layer w0.5: D8.2 arc(90.08,32.61) D7.1
$2N2041: length 42.7
  Top Layer w0.75: C15.2 arc(102.76,24.06) 102.34,20.39 arc(100.89,15) 96.45,11.6 arc(84.66,11.05) R27.1
$2N2043: length 5.5
  Top Layer w0.5: R24.2 arc(87.33,17.38) Q6.1
$2N2045: length 3
  Top Layer w0.5: D1.2 R7.2
$2N2047: length 4
  Top Layer w0.5: R22.2 arc(72.12,102.11) Q4.3
$2N2049: length 4.4
  Top Layer w0.75: D5.1 arc(67.68,100.7) D6.2
$2N2051: length 4.3
  Top Layer w0.5: D3.1 arc(70.48,43.46) 71.86,41.83
$2N2061: length 13.7
  Top Layer w1: R27.2 arc(55.75,17.08) NOREF#3.2 arc(49.34,19.44) 46.5,21.46
$2N2069: length 61
  Top Layer w1: v3(63.28,56.92) arc(61.92,55.91) 60.33,55.34 arc(59.34,55.19) 58.35,55.14 arc(51.08,53.04) 45.95,47.47 arc(44.14,41.9) NOREF#2.3 arc(45,32.6) 46.5,29.38 ; R28.2 arc(60.94,73.36) v3(63.28,70.02)
  Bottom Layer w1: v3(63.28,70.02) v3(63.28,56.92)
$2N9719: length 12.8
  Top Layer w0.75: 97.39,51.62 R29.2 arc(92.33,53.64) C7.2
$2N9761: length 13
  Top Layer w0.75: R31.2 R32.1 arc(103.48,101.19) 100.66,100.2 arc(98.93,99.06) C8.2

## Copper pours and planes (outline as drawn; the poured copper is in the pictures)
40V on Top Layer: 9.68,98.89 9.7,99.17 9.76,99.45 9.86,99.72 10,99.97 10.17,100.2 10.37,100.4 10.6,100.57 10.85,100.71 11.12,100.81 11.4,100.87 11.68,100.89 12.76,100.89 13.05,100.87 13.33,100.81 13.59,100.71 13.84,100.57 14.07,100.4 14.27,100.2 14.44,99.97 14.58,99.72 14.68,99.45 14.74,99.17 14.76,98.89 14.76,90.31 14.74,90.03 14.68,89.75 14.58,89.48 14.44,89.23 14.27,89 14.07,88.8 13.84,88.63 13.59,88.49 13.33,88.39 13.05,88.33 12.76,88.31 11.68,88.31 11.4,88.33 11.12,88.39 10.85,88.49 10.6,88.63 10.37,88.8 10.17,89 10,89.23 9.86,89.48 9.76,89.75 9.7,90.03 9.68,90.31
40V on Bottom Layer: 9.68,98.89 9.7,99.17 9.76,99.45 9.86,99.72 10,99.97 10.17,100.2 10.37,100.4 10.6,100.57 10.85,100.71 11.12,100.81 11.4,100.87 11.68,100.89 12.76,100.89 13.05,100.87 13.33,100.81 13.59,100.71 13.84,100.57 14.07,100.4 14.27,100.2 14.44,99.97 14.58,99.72 14.68,99.45 14.74,99.17 14.76,98.89 14.76,90.31 14.74,90.03 14.68,89.75 14.58,89.48 14.44,89.23 14.27,89 14.07,88.8 13.84,88.63 13.59,88.49 13.33,88.39 13.05,88.33 12.76,88.31 11.68,88.31 11.4,88.33 11.12,88.39 10.85,88.49 10.6,88.63 10.37,88.8 10.17,89 10,89.23 9.86,89.48 9.76,89.75 9.7,90.03 9.68,90.31
GNDREF on Top Layer: 9.68,106.63 9.7,106.92 9.76,107.2 9.86,107.46 10,107.71 10.17,107.94 10.37,108.14 10.6,108.31 10.85,108.45 11.12,108.55 11.4,108.61 11.68,108.63 12.76,108.63 13.05,108.61 13.33,108.55 13.59,108.45 13.84,108.31 14.07,108.14 14.27,107.94 14.44,107.71 14.58,107.46 14.68,107.2 14.74,106.92 14.76,106.63 14.76,103 14.74,102.71 14.68,102.43 14.58,102.17 14.44,101.92 14.27,101.69 14.07,101.49 13.84,101.31 13.59,101.18 13.33,101.08 13.05,101.02 12.76,101 11.68,101 11.4,101.02 11.12,101.08 10.85,101.18 10.6,101.31 10.37,101.49 10.17,101.69 10,101.92 9.86,102.17 9.76,102.43 9.7,102.71 9.68,103
GNDREF on Bottom Layer: 9.68,106.63 9.7,106.92 9.76,107.2 9.86,107.46 10,107.71 10.17,107.94 10.37,108.14 10.6,108.31 10.85,108.45 11.12,108.55 11.4,108.61 11.68,108.63 12.76,108.63 13.05,108.61 13.33,108.55 13.59,108.45 13.84,108.31 14.07,108.14 14.27,107.94 14.44,107.71 14.58,107.46 14.68,107.2 14.74,106.92 14.76,106.63 14.76,103 14.74,102.71 14.68,102.43 14.58,102.17 14.44,101.92 14.27,101.69 14.07,101.49 13.84,101.31 13.59,101.18 13.33,101.08 13.05,101.02 12.76,101 11.68,101 11.4,101.02 11.12,101.08 10.85,101.18 10.6,101.31 10.37,101.49 10.17,101.69 10,101.92 9.86,102.17 9.76,102.43 9.7,102.71 9.68,103
GNDS on Bottom Layer: 1.24,109.81 1.26,110.16 1.31,110.56 1.41,110.94 1.54,111.32 1.71,111.68 1.91,112.03 2.15,112.35 2.42,112.64 2.71,112.91 3.03,113.15 3.37,113.35 3.74,113.52 4.11,113.65 4.5,113.74 4.89,113.8 5.24,113.81 130.65,113.81 131,113.8 131.39,113.74 131.78,113.65 132.16,113.52 132.52,113.35 132.86,113.15 133.18,112.91 133.48,112.64 133.75,112.35 133.98,112.03 134.19,111.68 134.35,111.32 134.49,110.94 134.58,110.56 134.63,110.16 134.65,109.81 134.65,5.49 134.63,5.15 134.58,4.75 134.49,4.36 134.35,3.99 134.19,3.63 133.98,3.28 133.75,2.96 133.48,2.67 133.18,2.4 132.86,2.16 132.52,1.96 132.16,1.79 131.78,1.66 131.39,1.56 131,1.51 130.65,1.49 5.24,1.49 4.89,1.51 4.5,1.56 4.11,1.66 3.74,1.79 3.37,1.96 3.03,2.16 2.71,2.4 2.42,2.67 2.15,2.96 1.91,3.28 1.71,3.63 1.54,3.99 1.41,4.36 1.31,4.75 1.26,5.15 1.24,5.49
$2N1856 on Top Layer: 78.69,48.31 83.29,43.46 82.28,42.03 78.82,42.39 77.7,47.06
$2N1862 on Top Layer: 54.03,109.34 56.45,109.38 57.15,109.1 57.46,108.41 57.59,103.6 56.35,103.6 53.79,108.83
$2N1884 on Top Layer: 71.6,30.69 78.77,31.62 79.27,30.96 75.52,25.27 74.72,25.27 71.51,29.99
$2N1892 on Top Layer: 80.45,31.52 84.56,31.72 85.02,30.35 85.02,26.42 83.14,26.42 80.29,30.6
$2N1892 on Top Layer: 97.72,33.94 97.74,34.22 97.8,34.5 97.9,34.77 98.04,35.02 98.21,35.25 98.41,35.45 98.64,35.62 98.89,35.76 99.16,35.86 99.43,35.92 99.72,35.94 99.02,35.94 99.31,35.92 99.58,35.86 99.85,35.76 100.1,35.62 100.33,35.45 100.53,35.25 100.7,35.02 100.84,34.77 100.94,34.5 101,34.22 101.02,33.94 101.02,20.66 101,20.38 100.94,20.1 100.84,19.83 100.7,19.58 100.53,19.36 100.33,19.15 100.1,18.98 99.85,18.85 99.58,18.75 99.31,18.69 99.02,18.66 99.72,18.66 99.43,18.69 99.16,18.75 98.89,18.85 98.64,18.98 98.41,19.15 98.21,19.36 98.04,19.58 97.9,19.83 97.8,20.1 97.74,20.38 97.72,20.66
$2N1924 on Top Layer: 70.34,87.96 74.37,88.21 74.55,88.2 74.73,88.16 78.72,86.89 78.5,86.2 78.32,85.87 78.04,85.63 73.34,82.99 72.56,82.91 71.95,83.42 70.33,86.75 70.23,87.05 70.24,87.36
$2N1930 on Top Layer: 54.03,100.66 62.62,94.26 61.88,93.49 61.17,93.02 60.34,92.88 54.99,93.15 53.65,93.75 53.09,95.11 53.02,99.7
$2N1936 on Top Layer: 96.96,89.26 96.98,89.54 97.04,89.82 97.14,90.09 97.27,90.34 97.45,90.57 97.65,90.77 97.88,90.94 98.13,91.08 98.39,91.18 98.67,91.24 98.96,91.26 98.26,91.26 98.54,91.24 98.82,91.18 99.09,91.08 99.34,90.94 99.57,90.77 99.77,90.57 99.94,90.34 100.08,90.09 100.18,89.82 100.24,89.54 100.26,89.26 100.26,75.99 100.24,75.7 100.18,75.42 100.08,75.16 99.94,74.91 99.77,74.68 99.57,74.48 99.34,74.3 99.09,74.17 98.82,74.07 98.54,74.01 98.26,73.99 98.96,73.99 98.67,74.01 98.39,74.07 98.13,74.17 97.88,74.3 97.65,74.48 97.45,74.68 97.27,74.91 97.14,75.16 97.04,75.42 96.98,75.7 96.96,75.99
$2N1936 on Top Layer: 79.94,86.84 84.1,87.45 84.55,86.19 84.6,86.02 84.61,85.85 84.56,81.71 83.32,81.72 82.84,81.85 82.48,82.19 79.83,86.43
$2N1985 on Top Layer: 56.57,52.09 58.99,52.13 59.69,51.85 60,51.15 60.13,46.35 58.89,46.35 56.33,51.58
$2N2004 on Top Layer: 75.69,105.56 81.82,100.81 80.8,99.5 77.87,99.78 76.88,100.16 76.23,100.98 74.66,104.62
$2N2031 on Top Layer: 56.37,43.76 64.7,36.94 63.96,36.17 63.25,35.7 62.42,35.56 57.07,35.83 55.73,36.44 55.17,37.8 55.25,43.2

Small or netless copper shapes (teardrops, artwork), in the pictures only: 182 on Top Layer, 37 on Bottom Layer

## Text on the board
Top Silkscreen Layer: Signal GND | Right | Left | L  GND  R | - | + | R L | DiscoTech | Cue / Scott Carson / Rev. 2
